# Altium project ElectricalSystem2021.PrjPCB
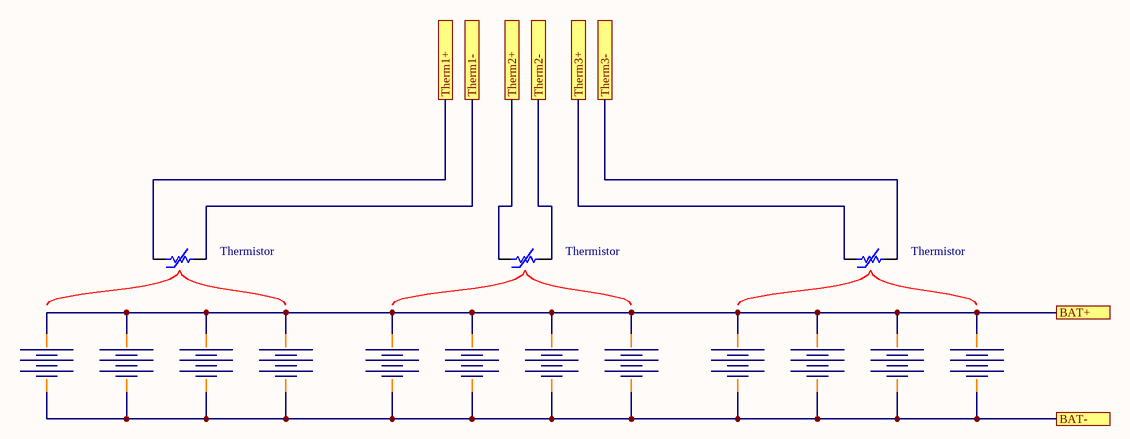
[diagram p0: BatteryModule.SchDoc]
1 sheet, 15 parts. Net scope: flat (ports and power ports of the same name join across sheets).

## Sheet BatteryModule.SchDoc
size A

### Parts
(Parts that share a designator on the sheet are numbered #1, #2 ... from top to bottom, then left to right.)
*#1  Thermistor
*#2  Battery  (value not drawn)
*#3  Battery  (value not drawn)
*#4  Battery  (value not drawn)
*?#1  Thermistor
*?#2  Thermistor
*?#3  Battery  (value not drawn)
*?#4  Battery  (value not drawn)
*?#5  Battery  (value not drawn)
*?#6  Battery  (value not drawn)
*?#7  Battery  (value not drawn)
*?#8  Battery  (value not drawn)
*?#9  Battery  (value not drawn)
*?#10  Battery  (value not drawn)
*?#11  Battery  (value not drawn)

### Ports
BAT+, BAT-, Therm1+, Therm1-, Therm2+, Therm2-, Therm3+, Therm3-

### Nets
Net*#1_1: *#1.1 ; port Therm1+
Net*#1_2: *#1.2 ; port Therm1-
Net*#2_1: *#2.1 *#3.1 *#4.1 *?#3.1 *?#4.1 *?#5.1 *?#6.1 *?#7.1 *?#8.1 *?#9.1 *?#10.1 *?#11.1 ; port BAT+
Net*#2_2: *#2.2 *#3.2 *#4.2 *?#3.2 *?#4.2 *?#5.2 *?#6.2 *?#7.2 *?#8.2 *?#9.2 *?#10.2 *?#11.2 ; port BAT-
Net*?#1_1: *?#1.1 ; port Therm2+
Net*?#1_2: *?#1.2 ; port Therm2-
Net*?#2_1: *?#2.1 ; port Therm3+
Net*?#2_2: *?#2.2 ; port Therm3-